# Altium project EEG AFE Project.PrjPcb (part 2 of 2)

## Sheet EEG AFE Sheet 3.SchDoc
size A4; SheetNumber: 3; SheetTotal: 4
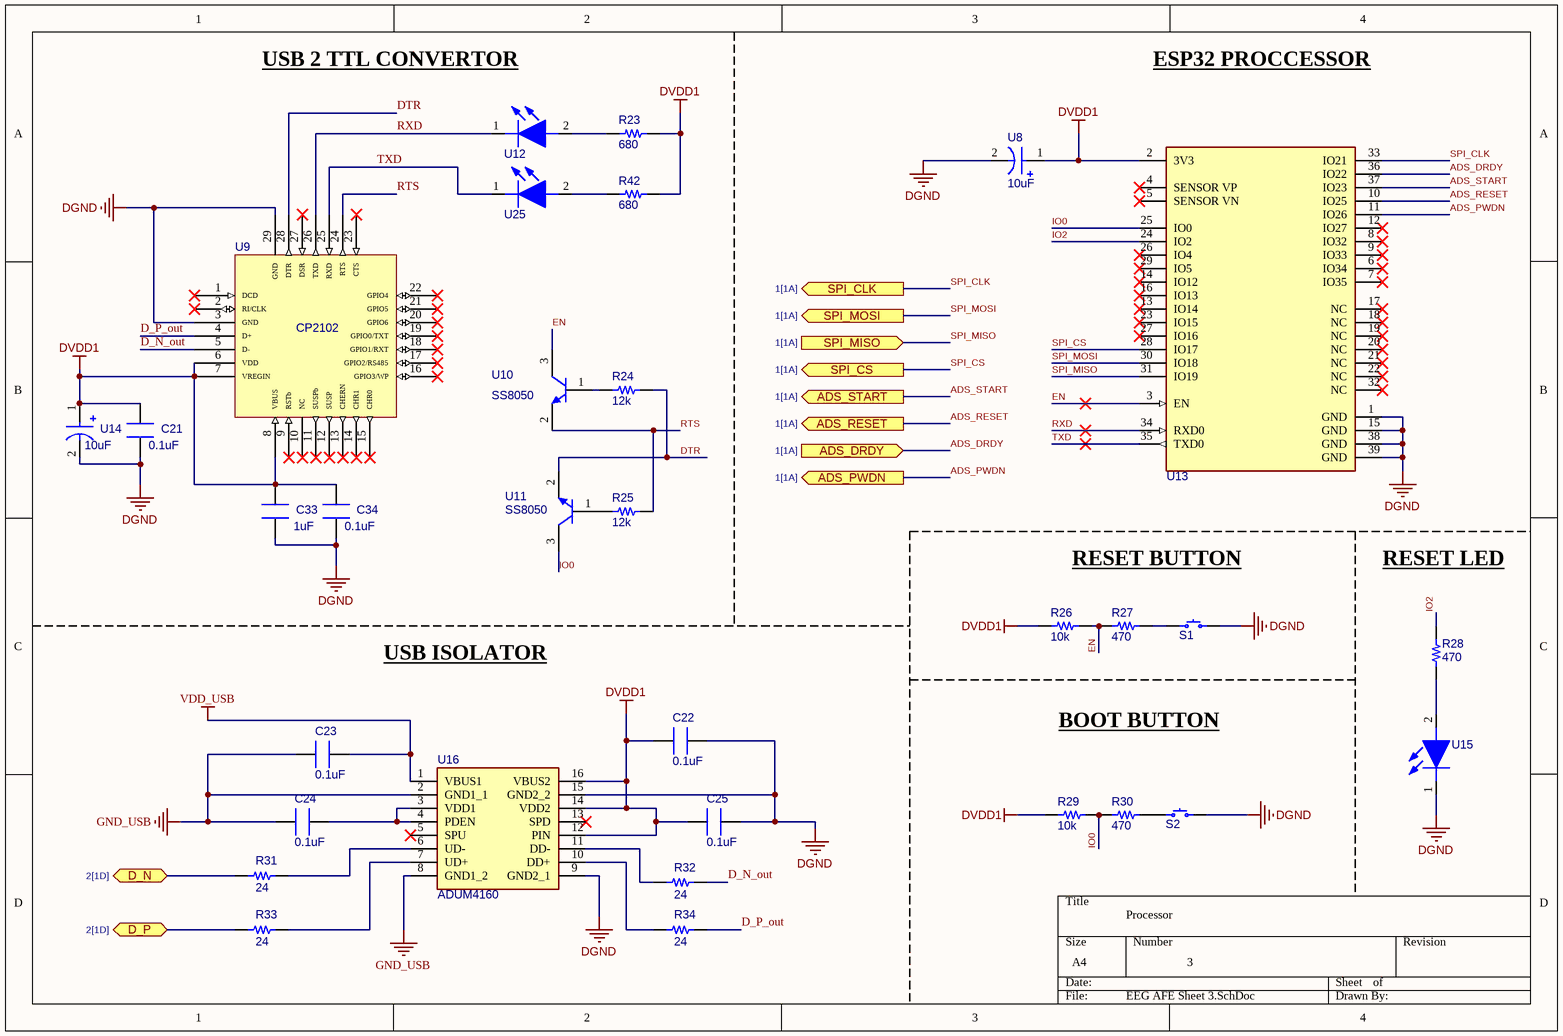
[diagram p2: EEG AFE Sheet 3.SchDoc]

### Parts
C21  0.1uF  [CAP 0603_1608]
C22  0.1uF  [CAP 0603_1608]
C23  0.1uF  [CAP 0603_1608]
C24  0.1uF  [CAP 0603_1608]
C25  0.1uF  [CAP 0603_1608]
C33  1uF  [CAP 0603_1608]
C34  0.1uF  [CAP 0603_1608]
R23  680  [RES 0603_1608]
R24  12k  [RES 0603_1608]
R25  12k  [RES 0603_1608]
R26  10k  [RES 0603_1608]
R27  470  [RES 0603_1608]
R28  470  [RES 0603_1608]
R29  10k  [RES 0603_1608]
R30  470  [RES 0603_1608]
R31  24  [RES 0603_1608]
R32  24  [RES 0603_1608]
R33  24  [RES 0603_1608]
R34  24  [RES 0603_1608]
R42  680  [RES 0603_1608]
S1  *  [PTS636SM25FSMTRLFS]  (value not drawn)
S2  *  [PTS636SM25FSMTRLFS]  (value not drawn)
U8  10uF  [CAPC0805_TANT]
U9  CP2102  [QFN50P500X500X80_HS-29N]
U10  SS8050  [MCCSEMI SOT-23-3]
U11  SS8050  [MCCSEMI SOT-23-3]
U12  *  [LEDC2012X80N]  (value not drawn)
U13  *  [FP-ESP32-WROOM-32E_4MB-MFG]  (value not drawn)
U14  10uF  [CAPC0805_TANT]
U15  *  [LEDC2012X80N]  (value not drawn)
U16  ADUM4160  [SOIC127P1030X265-16N]
U25  *  [LEDC2012X80N]  (value not drawn)

### Ports
ADS_DRDY (in, see 1[1A]), ADS_PWDN (out, see 1[1A]), ADS_RESET (out, see 1[1A]), ADS_START (out, see 1[1A]), D_N (bidir, see 2[1D]), D_P (bidir, see 2[1D]), SPI_CLK (out, see 1[1A]), SPI_CS (out, see 1[1A]), SPI_MISO (in, see 1[1A]), SPI_MOSI (out, see 1[1A])

### Nets
DGND: C21.1 C22.1 C25.1 C33.1 C34.1 S1.1 S2.1 U8.2(A) U9.3(GND) U9.29(GND) U13.1(GND) U13.15(GND) U13.38(GND) U13.39(GND) U14.2(A) U15.1(K) U16.9(GND2_1) U16.15(GND2_2)
DVDD1: C21.2 C22.2 C25.2 C33.2 C34.2 R23.1 R26.1 R29.1 R42.1 U8.1(C) U9.6(VDD) U9.7(VREGIN) U9.8(VBUS) U13.2(3V3) U14.1(C) U16.12(PIN) U16.14(VDD2) U16.16(VBUS2)
GND_USB: C23.2 C24.2 U16.2(GND1_1) U16.8(GND1_2)
VDD_USB: C23.1 U16.1(VBUS1)
ADS_DRDY: U13.36(IO22) ; port ADS_DRDY
ADS_PWDN: U13.11(IO26) ; port ADS_PWDN
ADS_RESET: U13.10(IO25) ; port ADS_RESET
ADS_START: U13.37(IO23) ; port ADS_START
D_N_out: R32.1 U9.5(D-)
D_P_out: R34.1 U9.4(D+)
DTR: R24.1 U9.28(DTR) U11.2(E)
EN: R26.2 R27.1 U10.3(C) U13.3(EN)
IO0: R29.2 R30.1 U11.3(C) U13.25(IO0)
IO2: R28.2 U13.24(IO2)
RTS: R25.1 U9.24(RTS) U10.2(E)
RXD: U9.26(TXD) U12.1(K) U13.34(RXD0)
SPI_CLK: U13.33(IO21) ; port SPI_CLK
SPI_CS: U13.28(IO17) ; port SPI_CS
SPI_MISO: U13.31(IO19) ; port SPI_MISO
SPI_MOSI: U13.30(IO18) ; port SPI_MOSI
TXD: U9.25(RXD) U13.35(TXD0) U25.1(K)
NetC24_1: C24.1 U16.3(VDD1) U16.4(PDEN)
NetCON1_2: R31.2 ; port D_N
NetCON1_3: R33.2 ; port D_P
NetR23_2: R23.2 U12.2(A)
NetR24_2: R24.2 U10.1(B)
NetR25_2: R25.2 U11.1(B)
NetR27_2: R27.2 S1.2
NetR28_1: R28.1 U15.2(A)
NetR30_2: R30.2 S2.2
NetR31_1: R31.1 U16.6(UD-)
NetR32_2: R32.2 U16.11(DD-)
NetR33_1: R33.1 U16.7(UD+)
NetR34_2: R34.2 U16.10(DD+)
NetR42_2: R42.2 U25.2(A)

Not connected (* = marked no-connect by the designer): U9 1(DCD)* 2(RI/CLK)* 9(RSTb)* 10(NC)* 11(SUSPb)* 12(SUSP)* 13(CHERN)* 14(CHR1)* 15(CHR0)* 16(GPIO3/WP)* 17(GPIO2/RS485)* 18(GPIO1/RXT)* 19(GPIO0/TXT)* 20(GPIO6)* 21(GPIO5)* 22(GPIO4)* 23(CTS)* 27(DSR)*; U13 4(SENSOR_VP)* 5(SENSOR_VN)* 6(IO34)* 7(IO35)* 8(IO32)* 9(IO33)* 12(IO27)* 13(IO14)* 14(IO12)* 16(IO13)* 17(NC)* 18(NC)* 19(NC)* 20(NC)* 21(NC)* 22(NC)* 23(IO15)* 26(IO4)* 27(IO16)* 29(IO5)* 32(NC)*; U16 5(SPU)* 13(SPD)*

### Notes on the sheet
- USB 2 TTL CONVERTOR
- ESP32 PROCCESSOR
- RESET BUTTON
- RESET LED
- USB ISOLATOR
- BOOT BUTTON
- Processor
- 3

### Library data of the parts
C21-C25 C33 C34 = 08055C104KAT2A: Ceramic Capacitor, Multilayer, Ceramic, 50V, 10% +Tol, 10% -Tol, X7R, 15% TC, 0.1uF, Surface Mount, 0805; Manufacturer: ???; Capacitance: 100nF; Multilayer: Yes; Package: CAP 0603_1608; Part Number: *; Value: *; Voltage: *; Tolerance: *; ComponentLink1Description: Datasheet; Current Rating: *; Supplier 1: Mouser; Manufacturer Part Number: 08055C104KAT2A; RoHS: Yes; Category: Ceramic Capacitors; Stock 1: 1865681; Pricing 1: 1=0.1, 10=0.037, 50=0.037, 100=0.022, 1000=0.017, 10000=0.013 (USD); Mount: Surface Mount; Number of Pins: 2; Dielectric Material: Ceramic; Package Shape: Rectangular; Size Code: 0805; Terminal Finish: Nickel; Min Operating Temperature: -55°C; Max Operating Temperature: 125°C; JESD-609 Code: e3; Capacitor Type: Ceramic; Negative Tolerance: 10%; Package Style: SMTMeter; Packaging: Tape and Reel; Positive Tolerance: 10%; Rated DC Voltage (URdc): 50V; Temperature Characteristics Code: X7R; Termination: Wraparound; Length: 2.01mm; Width: 1.25mm; Height: 0.94mm; Reach SVHC Compliant: Yes; RoHS Compliant: Yes; ComponentLink2URL: https://datasheet.ciiva.com:443/pdfs/VipMasterIC/IC/AVXC/AVXC-S-A0009640452/AVXC-S-A0009640452-1.pdf?src-supplier=IHS+Markit; ComponentLink2Description: https://datasheet.ciiva.com:443/pdfs/VipMasterIC/IC/AVXC/AVXC-S-A0009640452/AVXC-S-A0009640452-1.pdf?src-supplier=IHS+Markit; ComponentLink3URL: https://datasheet.ciiva.com/19475/2009691-19475858.pdf?src-supplier=Jameco; ComponentLink3Description: https://datasheet.ciiva.com/19475/2009691-19475858.pdf?src-supplier=Jameco; ComponentLink4URL: https://datasheet.ciiva.com/11786/0900766b802d4698-11786116.pdf?src-supplier=Rs; ComponentLink4Description: https://datasheet.ciiva.com/11786/0900766b802d4698-11786116.pdf?src-supplier=Rs; ComponentLink5URL: https://datasheet.ciiva.com/2988/cx7r-2988014.pdf?src-supplier=Avnet; ComponentLink5Description: https://datasheet.ciiva.com/2988/cx7r-2988014.pdf?src-supplier=Avnet; ComponentLink6URL: https://datasheet.ciiva.com/16199/cx7r-16199014.pdf?src-supplier=Future+Electronics; ComponentLink6Description: https://datasheet.ciiva.com/16199/cx7r-16199014.pdf?src-supplier=Future+Electronics; ComponentLink7URL: https://datasheet.ciiva.com/11504/cx7r-11504044.pdf?src-supplier=Avnet; ComponentLink7Description: https://datasheet.ciiva.com/11504/cx7r-11504044.pdf?src-supplier=Avnet; ComponentLink8URL: https://datasheet.ciiva.com/150/cx7r-150258.pdf?src-supplier=Digi-Key; ComponentLink8Description: https://datasheet.ciiva.com/150/cx7r-150258.pdf?src-supplier=Digi-Key; ComponentLink9URL: https://datasheet.ciiva.com/150/cx7r-150257.pdf?src-supplier=Digi-Key; ComponentLink9Description: https://datasheet.ciiva.com/150/cx7r-150257.pdf?src-supplier=Digi-Key; ComponentLink10URL: https://datasheet.ciiva.com/150/cx7r-150259.pdf?src-supplier=Digi-Key; ComponentLink10Description: https://datasheet.ciiva.com/150/cx7r-150259.pdf?src-supplier=Digi-Key; ComponentLink11URL: https://datasheet.ciiva.com/7812/cx7r-7812079.pdf?src-supplier=Element14; ComponentLink11Description: https://datasheet.ciiva.com/7812/cx7r-7812079.pdf?src-supplier=Element14; ComponentLink12URL: https://datasheet.ciiva.com/5416/cx7r-5416959.pdf?src-supplier=Mouser; ComponentLink12Description: https://datasheet.ciiva.com/5416/cx7r-5416959.pdf?src-supplier=Mouser; Supplier Part Number 1: 581-08055C104K
R23-R34 R42 = RC0805FR-0710KL: Fixed Resistor, Metal Glaze/thick Film, 0.125W, 10000ohm, 150V, 1% +/-Tol, 100ppm/Cel, Surface Mount, 0805; Manufacturer: ???; Additional Feature: LASER TRIMMABLE; Rated Power Dissipation (P): 125mW; Rated Temperature: 70°C; Resistance: 10kR; Temperature Coefficient: 100ppm/°C; Package Height: 0.5mm; Package Length: 2mm; Package Width: 1.25mm; Package: RES 0603_1608; Publisher: Paraqum Technologies; Part Number: *; Value: *; Voltage: *; Tolerance: *; ComponentLink1Description: Datasheet; Current Rating: *; Supplier 1: Mouser; Manufacturer Part Number: RC0805FR-0710KL; RoHS: Yes; Category: Chip SMD Resistors; Stock 1: 8413916; Pricing 1: 1=0.1, 10=0.034, 50=0.034, 100=0.014, 1000=0.007, 10000=0.004 (USD); Mount: Surface Mount; Number of Pins: 2; Package Shape: Rectangular; Size Code: 0805; Terminal Finish: Nickel; Min Operating Temperature: -55°C; Max Operating Temperature: 155°C; JESD-609 Code: e3; Termination: Wraparound; Resistor Type: FIXED RESISTOR; Construction: Chip; Package Style: SMTMeter; Packaging: Tape and Reel; Technology: METAL GLAZE/THICK FILM; Working Voltage: 150V; Reach SVHC Compliant: Yes; RoHS Compliant: Yes; ComponentLink2URL: https://datasheet.ciiva.com:443/pdfs/VipMasterIC/IC/YAGO/YAGO-S-A0008145938/YAGO-S-A0008145938-1.pdf?src-supplier=IHS+Markit; ComponentLink2Description: https://datasheet.ciiva.com:443/pdfs/VipMasterIC/IC/YAGO/YAGO-S-A0008145938/YAGO-S-A0008145938-1.pdf?src-supplier=IHS+Markit; ComponentLink3URL: https://datasheet.ciiva.com/46447/444164-46447563.pdf?src-supplier=Element14; ComponentLink3Description: https://datasheet.ciiva.com/46447/444164-46447563.pdf?src-supplier=Element14; ComponentLink4URL: https://datasheet.ciiva.com/2456/pyu-r-int-thick-7-2456973.pdf?src-supplier=Digi-Key; ComponentLink4Description: https://datasheet.ciiva.com/2456/pyu-r-int-thick-7-2456973.pdf?src-supplier=Digi-Key; ComponentLink5URL: https://datasheet.ciiva.com/2456/pyu-r-int-thick-7-2456974.pdf?src-supplier=Digi-Key; ComponentLink5Description: https://datasheet.ciiva.com/2456/pyu-r-int-thick-7-2456974.pdf?src-supplier=Digi-Key; ComponentLink6URL: https://datasheet.ciiva.com/2456/pyu-r-int-thick-7-2456972.pdf?src-supplier=Digi-Key; ComponentLink6Description: https://datasheet.ciiva.com/2456/pyu-r-int-thick-7-2456972.pdf?src-supplier=Digi-Key; ComponentLink7URL: https://datasheet.ciiva.com/12669/rc0805-12669688.pdf?src-supplier=Mouser; ComponentLink7Description: https://datasheet.ciiva.com/12669/rc0805-12669688.pdf?src-supplier=Mouser; ComponentLink8URL: https://datasheet.ciiva.com/16747/rc0805-16747087.pdf?src-supplier=Future+Electronics; ComponentLink8Description: https://datasheet.ciiva.com/16747/rc0805-16747087.pdf?src-supplier=Future+Electronics; Supplier Part Number 1: 603-RC0805FR-0710KL
S1 S2 = PTS636SM25FSMTRLFS: Keypad Switch, 1 Switches, SPST, Momentary-tactile, 0.05A, 12VDC, 2.06N, Solder Terminal, Surface Mount-straight; Manufacturer: ???; Package: PTS636SM25FSMTRLFS; Publisher: Paraqum Technologies; Part Number: *; Value: *; Voltage: *; Tolerance: *; ComponentLink1Description: Datasheet; Current Rating: *; Supplier 1: Mouser; Manufacturer Part Number: PTS636SM25FSMTRLFS; RoHS: No; Stock 1: 13003; Pricing 1: 1=0.18, 10=0.174, 50=0.174, 100=0.15, 1000=0.108, 10000=0.092 (USD); RoHS Compliant: Yes; Supplier Part Number 1: 611-PTS636SM25FSMTRL
U8 U14 = TPSR105K025R4000: Tantalum Capacitor, Polarized, Tantalum (dry/solid), 25V, 10% +Tol, 10% -Tol, 1uF, Surface Mount, 0805; Manufacturer: ???; ESR (Equivalent Series Resistance): 4R; Leakage Current: 500nA; Tan Delta: 0.04; Package: CAPC0805_TANT; Publisher: Paraqum Technologies; Part Number: *; Value: *; Voltage: *; Tolerance: *; ComponentLink1Description: Datasheet; Current Rating: *; Supplier 1: Mouser; Manufacturer Part Number: TPSR105K025R4000; RoHS: Yes; Category: Tantalum Capacitors; Stock 1: 11306; Pricing 1: 1=0.93, 10=0.656, 50=0.656, 100=0.431, 1000=0.272, 10000=0.205 (USD); Mount: Surface Mount; Number of Pins: 2; Dielectric Material: Tantalum; Package Shape: Rectangular; Size Code: 0805; Terminal Finish: Nickel; Min Operating Temperature: -55°C; Max Operating Temperature: 125°C; JESD-609 Code: e3; Polarity: Polarized; Capacitance: 1uF; Capacitor Type: Tantalum; Negative Tolerance: 10%; Package Style: SMTMeter; Packaging: Tape and Reel; Positive Tolerance: 10%; Rated DC Voltage (URdc): 25V; Termination: J BEND; Length: 2.05mm; Width: 1.3mm; Height: 1.2mm; Reach SVHC Compliant: Yes; RoHS Compliant: Yes; ComponentLink2URL: https://datasheet.ciiva.com:443/pdfs/VipMasterIC/IC/AVXC/AVXC-S-A0008980848/AVXC-S-A0008980848-1.pdf?src-supplier=IHS+Markit; ComponentLink2Description: https://datasheet.ciiva.com:443/pdfs/VipMasterIC/IC/AVXC/AVXC-S-A0008980848/AVXC-S-A0008980848-1.pdf?src-supplier=IHS+Markit; ComponentLink3URL: http://www.mouser.com/ds/2/40/tps-776850.pdf?src-supplier=Mouser; ComponentLink3Description: http://www.mouser.com/ds/2/40/tps-776850.pdf?src-supplier=Mouser; ComponentLink4URL: http://global.kyocera.com/prdct/electro/pdf/capacitors/taj-ce.pdf?src-supplier=Avnet; ComponentLink4Description: http://global.kyocera.com/prdct/electro/pdf/capacitors/taj-ce.pdf?src-supplier=Avnet; ComponentLink5URL: http://datasheets.avx.com/TPS.pdf?src-supplier=Digi-Key; ComponentLink5Description: http://datasheets.avx.com/TPS.pdf?src-supplier=Digi-Key; Supplier Part Number 1: 581-TPSR105K025R4000
U9 = CP2102N-A02-GQFN28R: USB Bus Controller, CMOS; Manufacturer: ???; Package: QFN50P500X500X80_HS-29N; Publisher: Paraqum Technologies; Part Number: *; Value: *; Voltage: *; Tolerance: *; ComponentLink1Description: Datasheet; Current Rating: *; Supplier 1: Mouser; Manufacturer Part Number: CP2102N-A02-GQFN28R; RoHS: Yes; Category: USB Interface ICs; Stock 1: 134938; Pricing 1: 1=4.35, 10=3.77, 50=3.39, 100=3.09, 1000=2.26, 10000=2.1 (USD); ComponentLink2URL: https://datasheet.ciiva.com:443/pdfs/VipMasterIC/IC/SILC/SILC-S-A0007770867/SILC-S-A0007770867-1.pdf?src-supplier=IHS+Markit; ComponentLink2Description: https://datasheet.ciiva.com:443/pdfs/VipMasterIC/IC/SILC/SILC-S-A0007770867/SILC-S-A0007770867-1.pdf?src-supplier=IHS+Markit; Supplier Part Number 1: 634-CP2102NA02QFN28R
U10 U11 = MMSS8050-H-TP: Small Signal Bipolar Transistor, 1.5A I(C), 25V V(BR)CEO, 1-Element, NPN, Silicon; Manufacturer: ???; Package Body Material: Plastic; DC Current Gain-Min (hFE): 200; Number of Elements: 1; Power Dissipation-Max (Abs): 300mW; Time @ Peak Reflow Temperature-Max (s): 10s; Transition Frequency-Nom (fT): 100MHz; Qualification Status: Not Qualified; Package: MCCSEMI SOT-23-3; Publisher: Paraqum Technologies; Part Number: *; Value: *; Voltage: *; Tolerance: *; ComponentLink1Description: Datasheet; Current Rating: *; Supplier 1: Mouser; Manufacturer Part Number: MMSS8050-H-TP; RoHS: Yes; Category: BJTs; Stock 1: 64780; Pricing 1: 1=0.21, 10=0.171, 50=0.171, 100=0.091, 1000=0.041, 10000=0.027 (USD); Number of Pins: 3; Package Shape: Rectangular; Terminal Finish: Tin; Transistor Element Material: SILICON; Max Operating Temperature: 150°C; JESD-609 Code: e3; Polarity/Channel Type: NPN; Max Collector Current: 1.5A; Collector-emitter Voltage-Max: 25V; JESD-30 Code: R-PDSO-G3; Moisture Sensitivity Level: 1; Package Style: SMALL OUTLINEMeter; Peak Reflow Temperature (Cel): 260°C; Surface Mount: Yes; Terminal Form: Gull Wing; Terminal Position: DUAL; Reach SVHC Compliant: Yes; RoHS Compliant: Yes; ComponentLink2URL: https://datasheet.ciiva.com:443/pdfs/VipMasterIC/IC/MCCC/MCCC-S-A0009689717/MCCC-S-A0009689962-1.pdf?src-supplier=IHS+Markit; ComponentLink2Description: https://datasheet.ciiva.com:443/pdfs/VipMasterIC/IC/MCCC/MCCC-S-A0009689717/MCCC-S-A0009689962-1.pdf?src-supplier=IHS+Markit; ComponentLink3URL: https://datasheet.ciiva.com/16291/mmss8050-255048-16291447.pdf?src-supplier=Mouser; ComponentLink3Description: https://datasheet.ciiva.com/16291/mmss8050-255048-16291447.pdf?src-supplier=Mouser; ComponentLink4URL: https://datasheet.ciiva.com/972/mmss8050sot-23-972894.pdf?src-supplier=Digi-Key; ComponentLink4Description: https://datasheet.ciiva.com/972/mmss8050sot-23-972894.pdf?src-supplier=Digi-Key; ComponentLink5URL: https://datasheet.ciiva.com/972/mmss8050sot-23-972895.pdf?src-supplier=Digi-Key; ComponentLink5Description: https://datasheet.ciiva.com/972/mmss8050sot-23-972895.pdf?src-supplier=Digi-Key; ComponentLink6URL: https://datasheet.ciiva.com/972/mmss8050sot-23-972893.pdf?src-supplier=Digi-Key; ComponentLink6Description: https://datasheet.ciiva.com/972/mmss8050sot-23-972893.pdf?src-supplier=Digi-Key; Supplier Part Number 1: 833-MMSS8050-H-TP
U12 U15 U25 = 150080BS75000: Single Color LED, Blue, Water Clear, 1.4mm; Manufacturer: ???; Shape: Rectangular; Forward Current-Max: 30mA; Luminous Intensity-Nom: 145mcd; Number of Functions: 1; Viewing Angle: 140°; Overall Height: 0.7mm; Package: LEDC2012X80N; Publisher: Paraqum Technologies; Part Number: *; Value: *; Voltage: *; Tolerance: *; ComponentLink1Description: Datasheet; Current Rating: *; Supplier 1: Mouser; Manufacturer Part Number: 150080BS75000; RoHS: Yes; Category: LEDs; Stock 1: 191914; Pricing 1: 1=0.19, 10=0.187, 50=0.176, 100=0.151, 1000=0.131, 10000=0.131 (USD); Mount: Surface Mount; Number of Pins: 2; Color: Blue; Min Operating Temperature: -40°C; Max Operating Temperature: 85°C; Lens Style: WATER CLEAR; Optoelectronic Device Type: SINGLE COLOR LED; Packaging: Tape and Reel; Size: 1.4mm; Terminal Pitch: 2.1mm; RoHS Compliant: Yes; Reach SVHC Compliant: Yes; ComponentLink2URL: https://datasheet.ciiva.com:443/pdfs/VipMasterIC/IC/MIDC/MIDC-S-A0007455543/MIDC-S-A0007455543-1.pdf?src-supplier=IHS+Markit; ComponentLink2Description: https://datasheet.ciiva.com:443/pdfs/VipMasterIC/IC/MIDC/MIDC-S-A0007455543/MIDC-S-A0007455543-1.pdf?src-supplier=IHS+Markit; ComponentLink3URL: https://datasheet.ciiva.com/22656/1740214-22656954.pdf?src-supplier=Element14; ComponentLink3Description: https://datasheet.ciiva.com/22656/1740214-22656954.pdf?src-supplier=Element14; ComponentLink4URL: https://datasheet.ciiva.com/23843/150080bs75000-23843251.pdf?src-supplier=Newark; ComponentLink4Description: https://datasheet.ciiva.com/23843/150080bs75000-23843251.pdf?src-supplier=Newark; ComponentLink5URL: https://datasheet.ciiva.com/29279/759433-da-01-en-chipled-0805-w-kl-blau-150080bs75000-29279203.pdf?src-supplier=Conrad; ComponentLink5Description: https://datasheet.ciiva.com/29279/759433-da-01-en-chipled-0805-w-kl-blau-150080bs75000-29279203.pdf?src-supplier=Conrad; ComponentLink6URL: https://datasheet.ciiva.com/29562/150080bs75000-29562923.pdf?src-supplier=Digi-Key; ComponentLink6Description: https://datasheet.ciiva.com/29562/150080bs75000-29562923.pdf?src-supplier=Digi-Key; ComponentLink7URL: https://datasheet.ciiva.com/29562/150080bs75000-29562922.pdf?src-supplier=Digi-Key; ComponentLink7Description: https://datasheet.ciiva.com/29562/150080bs75000-29562922.pdf?src-supplier=Digi-Key; Supplier Part Number 1: 710-150080BS75000
U13 = ESP32-WROOM-32E-N4: Multiprotocol Modules SMD Module ESP32-WROOM-32E, ESP32-D0WD-V3, 4 MB SPI flash, PCB antenna; Manufacturer: ???; Package: FP-ESP32-WROOM-32E_4MB-MFG; Publisher: Paraqum Technologies; Part Number: *; Value: *; Voltage: *; Tolerance: *; ComponentLink1Description: Datasheet; Current Rating: *; Supplier 1: Mouser; Manufacturer Part Number: ESP32-WROOM-32E-N4; RoHS: No; Category: Uncategorized; Stock 1: 36558; Pricing 1: 1=3, 10=3, 50=3, 100=3, 1000=3, 10000=3 (USD); Supplier Part Number 1: 356-ESP32WRM32E132PH
U16 = ADUM4160BRWZ: Interface Circuit, CMOS, PDSO16; Manufacturer: ???; Package Body Material: Plastic; Analog IC - Other Type: ANALOG CIRCUIT; Number of Functions: 1; Package Equivalence Code: SOP16,.4; Power Supplies: 3.3,5V; Supply Voltage-Max (Vsup): 5.5V; Supply Voltage-Min (Vsup): 3.1V; Supply Voltage-Nom (Vsup): 3.3V; Time @ Peak Reflow Temperature-Max (s): 40s; Qualification Status: Not Qualified; Package: SOIC127P1030X265-16N; Publisher: Paraqum Technologies; Part Number: *; Value: *; Voltage: *; Tolerance: *; ComponentLink1Description: Datasheet; Current Rating: *; Supplier 1: Mouser; Manufacturer Part Number: ADUM4160BRWZ; RoHS: Yes; Category: Interface ICs; Stock 1: 6804; Pricing 1: 1=13.89, 10=12.76, 50=12.24, 100=10.25, 1000=9.36, 10000=9.36 (USD); Package Code: SOP; Number of Pins: 16; Package Shape: Rectangular; Terminal Finish: Tin; Min Operating Temperature: -40°C; Max Operating Temperature: 105°C; JESD-609 Code: e3; JESD-30 Code: R-PDSO-G16; Moisture Sensitivity Level: 3; Package Style: SMALL OUTLINEMeter; Surface Mount: Yes; Technology: CMOS; Terminal Form: Gull Wing; Terminal Position: DUAL; Peak Reflow Temperature (Cel): 260°C; Length: 10.3mm; Width: 7.5mm; Height - Seated (Max): 2.65mm; Terminal Pitch: 1.27mm; Temperature Grade: INDUSTRIAL; Reach SVHC Compliant: Yes; RoHS Compliant: Yes; ComponentLink2URL: https://datasheet.ciiva.com:443/pdfs/VipMasterIC/IC/ANDI/ANDIS12222/ANDIS12222-1.pdf?src-supplier=IHS+Markit; ComponentLink2Description: https://datasheet.ciiva.com:443/pdfs/VipMasterIC/IC/ANDI/ANDIS12222/ANDIS12222-1.pdf?src-supplier=IHS+Markit; ComponentLink3URL: https://datasheet.ciiva.com/14185/adum4160-eng-tds-14185966.pdf?src-supplier=Distrelec; ComponentLink3Description: https://datasheet.ciiva.com/14185/adum4160-eng-tds-14185966.pdf?src-supplier=Distrelec; ComponentLink4URL: https://datasheet.ciiva.com/15134/getdatasheetpartid-307565-15134708.pdf?src-supplier=Verical; ComponentLink4Description: https://datasheet.ciiva.com/15134/getdatasheetpartid-307565-15134708.pdf?src-supplier=Verical; ComponentLink5URL: https://datasheet.ciiva.com/11772/0900766b80e480ef-11772203.pdf?src-supplier=Rs; ComponentLink5Description: https://datasheet.ciiva.com/11772/0900766b80e480ef-11772203.pdf?src-supplier=Rs; ComponentLink6URL: https://datasheet.ciiva.com/1148/1700957-1148095.pdf?src-supplier=Element14; ComponentLink6Description: https://datasheet.ciiva.com/1148/1700957-1148095.pdf?src-supplier=Element14; ComponentLink7URL: https://datasheet.ciiva.com/1148/1700957-1148094.pdf?src-supplier=Element14; ComponentLink7Description: https://datasheet.ciiva.com/1148/1700957-1148094.pdf?src-supplier=Element14; ComponentLink8URL: https://datasheet.ciiva.com/2081/adum4160-2081949.pdf?src-supplier=Digi-Key; ComponentLink8Description: https://datasheet.ciiva.com/2081/adum4160-2081949.pdf?src-supplier=Digi-Key; Supplier Part Number 1: 584-ADUM4160BRWZ

## Sheet EEG AFE Sheet 4.SchDoc
size A4; SheetNumber: 4; SheetTotal: 4
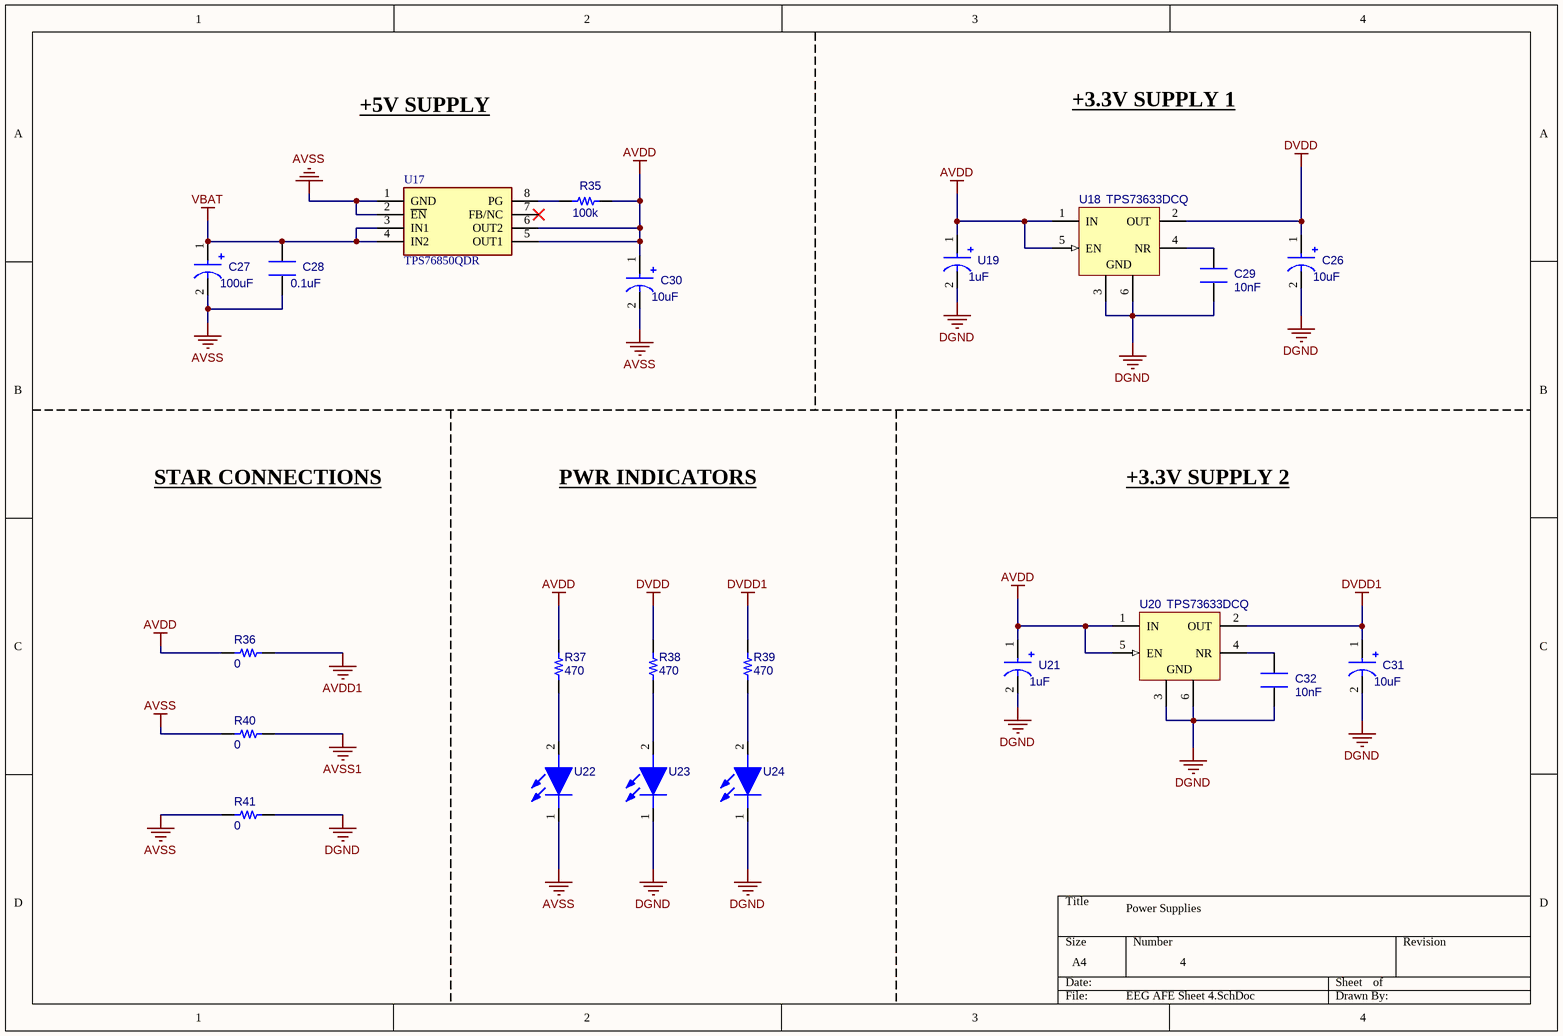
[diagram p3: EEG AFE Sheet 4.SchDoc]

### Parts
C26  10uF  [CAP ALSMD ELEC 4.3MM H5.4MM]
C27  100uF  [CAP ALSMD ELEC 6.6MM H7.7MM]
C28  0.1uF  [CAP 0603_1608]
C29  10nF  [CAP 0603_1608]
C30  10uF  [CAP ALSMD ELEC 4.3MM H5.4MM]
C31  10uF  [CAP ALSMD ELEC 4.3MM H5.4MM]
C32  10nF  [CAP 0603_1608]
R35  100k  [RES 0603_1608]
R36  0  [RES 0603_1608]
R37  470  [RES 0603_1608]
R38  470  [RES 0603_1608]
R39  470  [RES 0603_1608]
R40  0  [RES 0603_1608]
R41  0  [RES 0603_1608]
U17  TPS76850QDR  [SOIC127P600X175-8N]
U18  TPS73633DCQ  [SOT127P706X180-6N]
U19  1uF  [CAPC0805_TANT]
U20  TPS73633DCQ  [SOT127P706X180-6N]
U21  1uF  [CAPC0805_TANT]
U22  *  [LEDC2012X80N]  (value not drawn)
U23  *  [LEDC2012X80N]  (value not drawn)
U24  *  [LEDC2012X80N]  (value not drawn)

### Nets
AVDD: C30.1(C) R35.1 R36.2 R37.2 U17.5(OUT1) U17.6(OUT2) U18.1(IN) U18.5(EN) U19.1(C) U20.1(IN) U20.5(EN) U21.1(C)
AVDD1: R36.1
AVSS: C27.2(A) C28.1 C30.2(A) R40.2 R41.2 U17.1(GND) U17.2(~{EN}) U22.1(K)
AVSS1: R40.1
DGND: C26.2(A) C29.1 C31.2(A) C32.1 R41.1 U18.3(GND) U18.6(GND) U19.2(A) U20.3(GND) U20.6(GND) U21.2(A) U23.1(K) U24.1(K)
DVDD: C26.1(C) R38.2 U18.2(OUT)
DVDD1: C31.1(C) R39.2 U20.2(OUT)
VBAT: C27.1(C) C28.2 U17.3(IN1) U17.4(IN2)
NetC29_2: C29.2 U18.4(NR)
NetC32_2: C32.2 U20.4(NR)
NetR35_2: R35.2 U17.8(PG)
NetR37_1: R37.1 U22.2(A)
NetR38_1: R38.1 U23.2(A)
NetR39_1: R39.1 U24.2(A)

Not connected (* = marked no-connect by the designer): U17 7(FB/NC)*

### Notes on the sheet
- +5V SUPPLY
- +3.3V SUPPLY 1
- STAR CONNECTIONS
- PWR INDICATORS
- +3.3V SUPPLY 2
- Power Supplies
- 4

### Library data of the parts
C26 C30 C31 = EEE-FK1E100R: Aluminum Electrolytic Capacitor, Polarized, Aluminum (wet), 25V, 20% +Tol, 20% -Tol, 10uF, Surface Mount, 1717; Manufacturer: ???; Dielectric Material: Aluminium; Leakage Current: 2.5uA; Ripple Current: 67.5mA; Tan Delta: 0.14; Reference Standard: AEC-Q200; Package: CAP ALSMD ELEC 4.3MM H5.4MM; Part Number: *; Value: *; Voltage: *; Tolerance: *; ComponentLink1Description: Datasheet; Current Rating: *; Supplier 1: Mouser; Manufacturer Part Number: EEE-FK1E100R; RoHS: Yes; Category: Aluminum Electrolytic Capacitors; Stock 1: 28194; Pricing 1: 1=0.5, 10=0.342, 50=0.239, 100=0.205, 1000=0.145, 10000=0.136 (USD); Mount: Surface Mount; Number of Pins: 2; Size Code: 1717; Min Operating Temperature: -55°C; Max Operating Temperature: 105°C; Polarity: Polarized; Capacitance: 10uF; Capacitor Type: Aluminium; Negative Tolerance: 20%; Package Style: SMTMeter; Packaging: Tape and Reel; Positive Tolerance: 20%; Rated DC Voltage (URdc): 25V; Termination: Flat; Length: 5.5mm; Width: 4.3mm; Height: 5.8mm; Reach SVHC Compliant: Yes; RoHS Compliant: Yes; ComponentLink2URL: https://datasheet.ciiva.com:443/pdfs/VipMasterIC/IC/PANA/PANA-S-A0009615195/PANA-S-A0009615195-1.pdf?src-supplier=IHS+Markit; ComponentLink2Description: https://datasheet.ciiva.com:443/pdfs/VipMasterIC/IC/PANA/PANA-S-A0009615195/PANA-S-A0009615195-1.pdf?src-supplier=IHS+Markit; ComponentLink3URL: https://datasheet.ciiva.com/27052/1357642-27052071.pdf?src-supplier=Jameco; ComponentLink3Description: https://datasheet.ciiva.com/27052/1357642-27052071.pdf?src-supplier=Jameco; ComponentLink4URL: https://datasheet.ciiva.com/43463/58258-43463510.pdf?src-supplier=Farnell; ComponentLink4Description: https://datasheet.ciiva.com/43463/58258-43463510.pdf?src-supplier=Farnell; ComponentLink5URL: https://datasheet.ciiva.com/46388/58258-46388648.pdf?src-supplier=Element14; ComponentLink5Description: https://datasheet.ciiva.com/46388/58258-46388648.pdf?src-supplier=Element14; ComponentLink6URL: https://datasheet.ciiva.com/24069/aba0000ce120-24069487.pdf?src-supplier=Mouser; ComponentLink6Description: https://datasheet.ciiva.com/24069/aba0000ce120-24069487.pdf?src-supplier=Mouser; ComponentLink7URL: https://datasheet.ciiva.com/43485/1676921-43485493.pdf?src-supplier=Farnell; ComponentLink7Description: https://datasheet.ciiva.com/43485/1676921-43485493.pdf?src-supplier=Farnell; ComponentLink8URL: https://datasheet.ciiva.com/46388/1676921-46388649.pdf?src-supplier=Element14; ComponentLink8Description: https://datasheet.ciiva.com/46388/1676921-46388649.pdf?src-supplier=Element14; ComponentLink9URL: https://datasheet.ciiva.com/6121/1676921-6121167.pdf?src-supplier=Farnell; ComponentLink9Description: https://datasheet.ciiva.com/6121/1676921-6121167.pdf?src-supplier=Farnell; ComponentLink10URL: https://datasheet.ciiva.com/46376/1676921-46376489.pdf?src-supplier=Element14; ComponentLink10Description: https://datasheet.ciiva.com/46376/1676921-46376489.pdf?src-supplier=Element14; ComponentLink11URL: https://datasheet.ciiva.com/2983/aba0000ce120-2983947.pdf?src-supplier=Avnet; ComponentLink11Description: https://datasheet.ciiva.com/2983/aba0000ce120-2983947.pdf?src-supplier=Avnet; ComponentLink12URL: https://datasheet.ciiva.com/16449/aba0000ce120-16449400.pdf?src-supplier=Future+Electronics; ComponentLink12Description: https://datasheet.ciiva.com/16449/aba0000ce120-16449400.pdf?src-supplier=Future+Electronics; ComponentLink13URL: https://datasheet.ciiva.com/30199/aba0000ce120-30199257.pdf?src-supplier=Onlinecomponents.com; ComponentLink13Description: https://datasheet.ciiva.com/30199/aba0000ce120-30199257.pdf?src-supplier=Onlinecomponents.com; ComponentLink14URL: https://datasheet.ciiva.com/15166/getdatasheetpartid-134702-15166021.pdf?src-supplier=Verical; ComponentLink14Description: https://datasheet.ciiva.com/15166/getdatasheetpartid-134702-15166021.pdf?src-supplier=Verical; Supplier Part Number 1: 667-EEE-FK1E100R
C27 = 865230345005: WCAP-AS5H Aluminum Electrolytic Capacitors; Manufacturer: ???; Package: CAP ALSMD ELEC 6.6MM H7.7MM; Publisher: Paraqum Technologies; Part Number: *; Value: *; Voltage: *; Tolerance: *; ComponentLink1Description: Datasheet; Current Rating: *; Supplier 1: Mouser; Manufacturer Part Number: 865230345005; RoHS: Yes; Category: Aluminum Electrolytic Capacitors; Stock 1: 13677; Pricing 1: 1=0.33, 10=0.33, 50=0.281, 100=0.245, 1000=0.185, 10000=0.185 (USD); ComponentLink2URL: http://www.farnell.com/datasheets/1880265.pdf?src-supplier=Farnell; ComponentLink2Description: http://www.farnell.com/datasheets/1880265.pdf?src-supplier=Farnell; ComponentLink3URL: http://www.farnell.com/datasheets/1880265.pdf?src-supplier=Element14; ComponentLink3Description: http://www.farnell.com/datasheets/1880265.pdf?src-supplier=Element14; ComponentLink4URL: http://www.farnell.com/datasheets/1880265.pdf?src-supplier=Newark; ComponentLink4Description: http://www.farnell.com/datasheets/1880265.pdf?src-supplier=Newark; ComponentLink5URL: http://katalog.we-online.de/pbs/datasheet/865230345005.pdf?src-supplier=Digi-Key; ComponentLink5Description: http://katalog.we-online.de/pbs/datasheet/865230345005.pdf?src-supplier=Digi-Key; ComponentLink6URL: https://katalog.we-online.de/pbs/datasheet/865230345005.pdf?src-supplier=Digi-Key; ComponentLink6Description: https://katalog.we-online.de/pbs/datasheet/865230345005.pdf?src-supplier=Digi-Key; Supplier Part Number 1: 710-865230345005
C28 C29 C32 = 08055C104KAT2A: as C21 on sheet EEG AFE Sheet 3; Package: CAP 0603_1608; Part Number: *; Value: *; Voltage: *; Tolerance: *; ComponentLink1Description: Datasheet; Current Rating: *; Supplier 1: Mouser; Manufacturer Part Number: 08055C104KAT2A; RoHS: Yes; Category: Ceramic Capacitors; Stock 1: 1865681; Pricing 1: 1=0.1, 10=0.037, 50=0.037, 100=0.022, 1000=0.017, 10000=0.013 (USD); Mount: Surface Mount; Number of Pins: 2; Dielectric Material: Ceramic; Package Shape: Rectangular; Size Code: 0805; Terminal Finish: Nickel; Min Operating Temperature: -55°C; Max Operating Temperature: 125°C; JESD-609 Code: e3; Capacitor Type: Ceramic; Negative Tolerance: 10%; Package Style: SMTMeter; Packaging: Tape and Reel; Positive Tolerance: 10%; Rated DC Voltage (URdc): 50V; Temperature Characteristics Code: X7R; Termination: Wraparound; Length: 2.01mm; Width: 1.25mm; Height: 0.94mm; Reach SVHC Compliant: Yes; RoHS Compliant: Yes; ComponentLink2URL: https://datasheet.ciiva.com:443/pdfs/VipMasterIC/IC/AVXC/AVXC-S-A0009640452/AVXC-S-A0009640452-1.pdf?src-supplier=IHS+Markit; ComponentLink2Description: https://datasheet.ciiva.com:443/pdfs/VipMasterIC/IC/AVXC/AVXC-S-A0009640452/AVXC-S-A0009640452-1.pdf?src-supplier=IHS+Markit; ComponentLink3URL: https://datasheet.ciiva.com/19475/2009691-19475858.pdf?src-supplier=Jameco; ComponentLink3Description: https://datasheet.ciiva.com/19475/2009691-19475858.pdf?src-supplier=Jameco; ComponentLink4URL: https://datasheet.ciiva.com/11786/0900766b802d4698-11786116.pdf?src-supplier=Rs; ComponentLink4Description: https://datasheet.ciiva.com/11786/0900766b802d4698-11786116.pdf?src-supplier=Rs; ComponentLink5URL: https://datasheet.ciiva.com/2988/cx7r-2988014.pdf?src-supplier=Avnet; ComponentLink5Description: https://datasheet.ciiva.com/2988/cx7r-2988014.pdf?src-supplier=Avnet; ComponentLink6URL: https://datasheet.ciiva.com/16199/cx7r-16199014.pdf?src-supplier=Future+Electronics; ComponentLink6Description: https://datasheet.ciiva.com/16199/cx7r-16199014.pdf?src-supplier=Future+Electronics; ComponentLink7URL: https://datasheet.ciiva.com/11504/cx7r-11504044.pdf?src-supplier=Avnet; ComponentLink7Description: https://datasheet.ciiva.com/11504/cx7r-11504044.pdf?src-supplier=Avnet; ComponentLink8URL: https://datasheet.ciiva.com/150/cx7r-150258.pdf?src-supplier=Digi-Key; ComponentLink8Description: https://datasheet.ciiva.com/150/cx7r-150258.pdf?src-supplier=Digi-Key; ComponentLink9URL: https://datasheet.ciiva.com/150/cx7r-150257.pdf?src-supplier=Digi-Key; ComponentLink9Description: https://datasheet.ciiva.com/150/cx7r-150257.pdf?src-supplier=Digi-Key; ComponentLink10URL: https://datasheet.ciiva.com/150/cx7r-150259.pdf?src-supplier=Digi-Key; ComponentLink10Description: https://datasheet.ciiva.com/150/cx7r-150259.pdf?src-supplier=Digi-Key; ComponentLink11URL: https://datasheet.ciiva.com/7812/cx7r-7812079.pdf?src-supplier=Element14; ComponentLink11Description: https://datasheet.ciiva.com/7812/cx7r-7812079.pdf?src-supplier=Element14; ComponentLink12URL: https://datasheet.ciiva.com/5416/cx7r-5416959.pdf?src-supplier=Mouser; ComponentLink12Description: https://datasheet.ciiva.com/5416/cx7r-5416959.pdf?src-supplier=Mouser; Supplier Part Number 1: 581-08055C104K
R35-R41 = RC0805FR-0710KL: as R23 on sheet EEG AFE Sheet 3; Package: RES 0603_1608; Publisher: Paraqum Technologies; Part Number: *; Value: *; Voltage: *; Tolerance: *; ComponentLink1Description: Datasheet; Current Rating: *; Supplier 1: Mouser; Manufacturer Part Number: RC0805FR-0710KL; RoHS: Yes; Category: Chip SMD Resistors; Stock 1: 8413916; Pricing 1: 1=0.1, 10=0.034, 50=0.034, 100=0.014, 1000=0.007, 10000=0.004 (USD); Mount: Surface Mount; Number of Pins: 2; Package Shape: Rectangular; Size Code: 0805; Terminal Finish: Nickel; Min Operating Temperature: -55°C; Max Operating Temperature: 155°C; JESD-609 Code: e3; Termination: Wraparound; Resistor Type: FIXED RESISTOR; Construction: Chip; Package Style: SMTMeter; Packaging: Tape and Reel; Technology: METAL GLAZE/THICK FILM; Working Voltage: 150V; Reach SVHC Compliant: Yes; RoHS Compliant: Yes; ComponentLink2URL: https://datasheet.ciiva.com:443/pdfs/VipMasterIC/IC/YAGO/YAGO-S-A0008145938/YAGO-S-A0008145938-1.pdf?src-supplier=IHS+Markit; ComponentLink2Description: https://datasheet.ciiva.com:443/pdfs/VipMasterIC/IC/YAGO/YAGO-S-A0008145938/YAGO-S-A0008145938-1.pdf?src-supplier=IHS+Markit; ComponentLink3URL: https://datasheet.ciiva.com/46447/444164-46447563.pdf?src-supplier=Element14; ComponentLink3Description: https://datasheet.ciiva.com/46447/444164-46447563.pdf?src-supplier=Element14; ComponentLink4URL: https://datasheet.ciiva.com/2456/pyu-r-int-thick-7-2456973.pdf?src-supplier=Digi-Key; ComponentLink4Description: https://datasheet.ciiva.com/2456/pyu-r-int-thick-7-2456973.pdf?src-supplier=Digi-Key; ComponentLink5URL: https://datasheet.ciiva.com/2456/pyu-r-int-thick-7-2456974.pdf?src-supplier=Digi-Key; ComponentLink5Description: https://datasheet.ciiva.com/2456/pyu-r-int-thick-7-2456974.pdf?src-supplier=Digi-Key; ComponentLink6URL: https://datasheet.ciiva.com/2456/pyu-r-int-thick-7-2456972.pdf?src-supplier=Digi-Key; ComponentLink6Description: https://datasheet.ciiva.com/2456/pyu-r-int-thick-7-2456972.pdf?src-supplier=Digi-Key; ComponentLink7URL: https://datasheet.ciiva.com/12669/rc0805-12669688.pdf?src-supplier=Mouser; ComponentLink7Description: https://datasheet.ciiva.com/12669/rc0805-12669688.pdf?src-supplier=Mouser; ComponentLink8URL: https://datasheet.ciiva.com/16747/rc0805-16747087.pdf?src-supplier=Future+Electronics; ComponentLink8Description: https://datasheet.ciiva.com/16747/rc0805-16747087.pdf?src-supplier=Future+Electronics; Supplier Part Number 1: 603-RC0805FR-0710KL
U17 = TPS76850QDR: LDO Voltage Regulators Micropower LDO Reg; Manufacturer_Name: Texas Instruments; Datasheet Link: https://www.ti.com/lit/ds/slvs211l/slvs211l.pdf; Height: 1.75mm; Manufacturer_Part_Number: TPS76850QDR; Mouser Part Number: 595-TPS76850QDR; Mouser Price/Stock: https://www.mouser.com/ProductDetail/Texas-Instruments/TPS76850QDR?qs=6zVL%252ByCp0moMPwCCXDl%252BJA%3D%3D; Arrow Part Number: TPS76850QDR; Arrow Price/Stock: https://www.arrow.com/en/products/tps76850qdr/texas-instruments
U18 U20 = TPS73633DCQ: Fixed Positive LDO Regulator, 3.3V, 0.2V Dropout, BICMOS, PDSO6; Manufacturer: ???; Package Body Material: Plastic; Dropout Voltage1-Max: 200mV; Dropout Voltage1-Nom: 75mV; Input Voltage Absolute-Max: 6V; Max Input Voltage: 5.5V; Min Input Voltage: 3.5V; Number of Functions: 1; Output Current1-Max: 400mA; Output Voltage1-Max: 3.333V; Output Voltage1-Min: 3.267V; Regulator Type: FIXED POSITIVE SINGLE OUTPUT LDO REGULATOR; Voltage Tolerance-Max: 1%; Qualification Status: Not Qualified; Package: SOT127P706X180-6N; Publisher: Paraqum Technologies; Part Number: *; Value: *; Voltage: *; Tolerance: *; ComponentLink1Description: Datasheet; Current Rating: *; Supplier 1: Mouser; Manufacturer Part Number: TPS73633DCQ; RoHS: Yes; Category: Voltage Regulators - Linear; Stock 1: 5912; Pricing 1: 1=2.95, 10=2.8, 50=2.65, 100=2.29, 1000=1.67, 10000=1.44 (USD); Package Code: SOP; Number of Pins: 6; Package Shape: Rectangular; Terminal Finish: Nickel; JESD-609 Code: e4; Adjustability: FIXED; JESD-30 Code: R-PDSO-G6; Moisture Sensitivity Level: 2; Number of Outputs: 1; Operating Temperature, TJ-Max: 125°C; Operating Temperature, TJ-Min: -40°C; Output Voltage1-Nom: 3.3V; Package Style: SMALL OUTLINEMeter; Packaging: Rail/Tube; Peak Reflow Temperature (Cel): 260°C; Surface Mount: Yes; Technology: BICMOS; Terminal Form: Gull Wing; Terminal Position: DUAL; Length: 6.5mm; Width: 3.5mm; Height - Seated (Max): 1.8mm; Terminal Pitch: 1.27mm; Reach SVHC Compliant: Yes; RoHS Compliant: Yes; ComponentLink2URL: https://www.ti.com:443/lit/ds/symlink/tps736.pdf?src-supplier=IHS+Markit; ComponentLink2Description: https://www.ti.com:443/lit/ds/symlink/tps736.pdf?src-supplier=IHS+Markit; ComponentLink3URL: https://datasheet.ciiva.com/2052/tps736-2052920.pdf?src-supplier=Digi-Key; ComponentLink3Description: https://datasheet.ciiva.com/2052/tps736-2052920.pdf?src-supplier=Digi-Key; Supplier Part Number 1: 595-TPS73633DCQ
U19 U21 = TPSR105K025R4000: as U8 on sheet EEG AFE Sheet 3; Package: CAPC0805_TANT; Publisher: Paraqum Technologies; Part Number: *; Value: *; Voltage: *; Tolerance: *; ComponentLink1Description: Datasheet; Current Rating: *; Supplier 1: Mouser; Manufacturer Part Number: TPSR105K025R4000; RoHS: Yes; Category: Tantalum Capacitors; Stock 1: 11306; Pricing 1: 1=0.93, 10=0.656, 50=0.656, 100=0.431, 1000=0.272, 10000=0.205 (USD); Mount: Surface Mount; Number of Pins: 2; Dielectric Material: Tantalum; Package Shape: Rectangular; Size Code: 0805; Terminal Finish: Nickel; Min Operating Temperature: -55°C; Max Operating Temperature: 125°C; JESD-609 Code: e3; Polarity: Polarized; Capacitance: 1uF; Capacitor Type: Tantalum; Negative Tolerance: 10%; Package Style: SMTMeter; Packaging: Tape and Reel; Positive Tolerance: 10%; Rated DC Voltage (URdc): 25V; Termination: J BEND; Length: 2.05mm; Width: 1.3mm; Height: 1.2mm; Reach SVHC Compliant: Yes; RoHS Compliant: Yes; ComponentLink2URL: https://datasheet.ciiva.com:443/pdfs/VipMasterIC/IC/AVXC/AVXC-S-A0008980848/AVXC-S-A0008980848-1.pdf?src-supplier=IHS+Markit; ComponentLink2Description: https://datasheet.ciiva.com:443/pdfs/VipMasterIC/IC/AVXC/AVXC-S-A0008980848/AVXC-S-A0008980848-1.pdf?src-supplier=IHS+Markit; ComponentLink3URL: http://www.mouser.com/ds/2/40/tps-776850.pdf?src-supplier=Mouser; ComponentLink3Description: http://www.mouser.com/ds/2/40/tps-776850.pdf?src-supplier=Mouser; ComponentLink4URL: http://global.kyocera.com/prdct/electro/pdf/capacitors/taj-ce.pdf?src-supplier=Avnet; ComponentLink4Description: http://global.kyocera.com/prdct/electro/pdf/capacitors/taj-ce.pdf?src-supplier=Avnet; ComponentLink5URL: http://datasheets.avx.com/TPS.pdf?src-supplier=Digi-Key; ComponentLink5Description: http://datasheets.avx.com/TPS.pdf?src-supplier=Digi-Key; Supplier Part Number 1: 581-TPSR105K025R4000
U22-U24 = 150080BS75000: as U12 on sheet EEG AFE Sheet 3; Package: LEDC2012X80N; Publisher: Paraqum Technologies; Part Number: *; Value: *; Voltage: *; Tolerance: *; ComponentLink1Description: Datasheet; Current Rating: *; Supplier 1: Mouser; Manufacturer Part Number: 150080BS75000; RoHS: Yes; Category: LEDs; Stock 1: 191914; Pricing 1: 1=0.19, 10=0.187, 50=0.176, 100=0.151, 1000=0.131, 10000=0.131 (USD); Mount: Surface Mount; Number of Pins: 2; Color: Blue; Min Operating Temperature: -40°C; Max Operating Temperature: 85°C; Lens Style: WATER CLEAR; Optoelectronic Device Type: SINGLE COLOR LED; Packaging: Tape and Reel; Size: 1.4mm; Terminal Pitch: 2.1mm; RoHS Compliant: Yes; Reach SVHC Compliant: Yes; ComponentLink2URL: https://datasheet.ciiva.com:443/pdfs/VipMasterIC/IC/MIDC/MIDC-S-A0007455543/MIDC-S-A0007455543-1.pdf?src-supplier=IHS+Markit; ComponentLink2Description: https://datasheet.ciiva.com:443/pdfs/VipMasterIC/IC/MIDC/MIDC-S-A0007455543/MIDC-S-A0007455543-1.pdf?src-supplier=IHS+Markit; ComponentLink3URL: https://datasheet.ciiva.com/22656/1740214-22656954.pdf?src-supplier=Element14; ComponentLink3Description: https://datasheet.ciiva.com/22656/1740214-22656954.pdf?src-supplier=Element14; ComponentLink4URL: https://datasheet.ciiva.com/23843/150080bs75000-23843251.pdf?src-supplier=Newark; ComponentLink4Description: https://datasheet.ciiva.com/23843/150080bs75000-23843251.pdf?src-supplier=Newark; ComponentLink5URL: https://datasheet.ciiva.com/29279/759433-da-01-en-chipled-0805-w-kl-blau-150080bs75000-29279203.pdf?src-supplier=Conrad; ComponentLink5Description: https://datasheet.ciiva.com/29279/759433-da-01-en-chipled-0805-w-kl-blau-150080bs75000-29279203.pdf?src-supplier=Conrad; ComponentLink6URL: https://datasheet.ciiva.com/29562/150080bs75000-29562923.pdf?src-supplier=Digi-Key; ComponentLink6Description: https://datasheet.ciiva.com/29562/150080bs75000-29562923.pdf?src-supplier=Digi-Key; ComponentLink7URL: https://datasheet.ciiva.com/29562/150080bs75000-29562922.pdf?src-supplier=Digi-Key; ComponentLink7Description: https://datasheet.ciiva.com/29562/150080bs75000-29562922.pdf?src-supplier=Digi-Key; Supplier Part Number 1: 710-150080BS75000

## Nets that join several sheets
AVDD: EEG AFE Sheet 1 (22 pins), EEG AFE Sheet 2 (U6.3 U7.3), EEG AFE Sheet 4 (12 pins)
AVDD1: EEG AFE Sheet 1 (C9.2 U1.54), EEG AFE Sheet 4 (R36.1)
AVSS: EEG AFE Sheet 1 (20 pins), EEG AFE Sheet 2 (HY1.2 U6.8 U7.8), EEG AFE Sheet 4 (8 pins)
AVSS1: EEG AFE Sheet 1 (C9.1 U1.53), EEG AFE Sheet 4 (R40.1)
DGND: EEG AFE Sheet 1 (15 pins), EEG AFE Sheet 3 (18 pins), EEG AFE Sheet 4 (13 pins)
DVDD: EEG AFE Sheet 1 (12 pins), EEG AFE Sheet 4 (C26.1 R38.2 U18.2)
DVDD1: EEG AFE Sheet 3 (18 pins), EEG AFE Sheet 4 (C31.1 R39.2 U20.2)
GND_USB: EEG AFE Sheet 2 (CON1.5), EEG AFE Sheet 3 (C23.2 C24.2 U16.2 U16.8)
VBAT: EEG AFE Sheet 2 (HY1.1), EEG AFE Sheet 4 (C27.1 C28.2 U17.3 U17.4)
VDD_USB: EEG AFE Sheet 2 (CON1.1), EEG AFE Sheet 3 (C23.1 U16.1)
ADS_DRDY: EEG AFE Sheet 1 (U1.47), EEG AFE Sheet 3 (U13.36)
ADS_PWDN: EEG AFE Sheet 1 (R9.2 U1.35), EEG AFE Sheet 3 (U13.11)
ADS_RESET: EEG AFE Sheet 1 (R8.2 U1.36), EEG AFE Sheet 3 (U13.10)
ADS_START: EEG AFE Sheet 1 (U1.38), EEG AFE Sheet 3 (U13.37)
BIASELEC: EEG AFE Sheet 1 (J1.3 J4.1), EEG AFE Sheet 2 (R22.2)
NetC15_1: EEG AFE Sheet 1 (U1.6), EEG AFE Sheet 2 (C15.1 R15.2)
NetC15_2: EEG AFE Sheet 1 (J2.3 J3.1), EEG AFE Sheet 2 (7 pins)
NetC16_1: EEG AFE Sheet 1 (U1.8), EEG AFE Sheet 2 (C16.1 R16.2)
NetC17_1: EEG AFE Sheet 1 (U1.10), EEG AFE Sheet 2 (C17.1 R17.2)
NetC18_1: EEG AFE Sheet 1 (U1.12), EEG AFE Sheet 2 (C18.1 R18.2)
NetC19_1: EEG AFE Sheet 1 (U1.14), EEG AFE Sheet 2 (C19.1 R19.2)
NetC20_1: EEG AFE Sheet 1 (U1.16), EEG AFE Sheet 2 (C20.1 R20.2)
NetCON1_2: EEG AFE Sheet 2 (CON1.2), EEG AFE Sheet 3 (R31.2)
NetCON1_3: EEG AFE Sheet 2 (CON1.3), EEG AFE Sheet 3 (R33.2)
SPI_CLK: EEG AFE Sheet 1 (U1.40), EEG AFE Sheet 3 (U13.33)
SPI_CS: EEG AFE Sheet 1 (R2.1 U1.39), EEG AFE Sheet 3 (U13.28)
SPI_MISO: EEG AFE Sheet 1 (U1.43), EEG AFE Sheet 3 (U13.31)
SPI_MOSI: EEG AFE Sheet 1 (U1.34), EEG AFE Sheet 3 (U13.30)